# EAGLE design avrdmx (EAGLE 6.5.0)
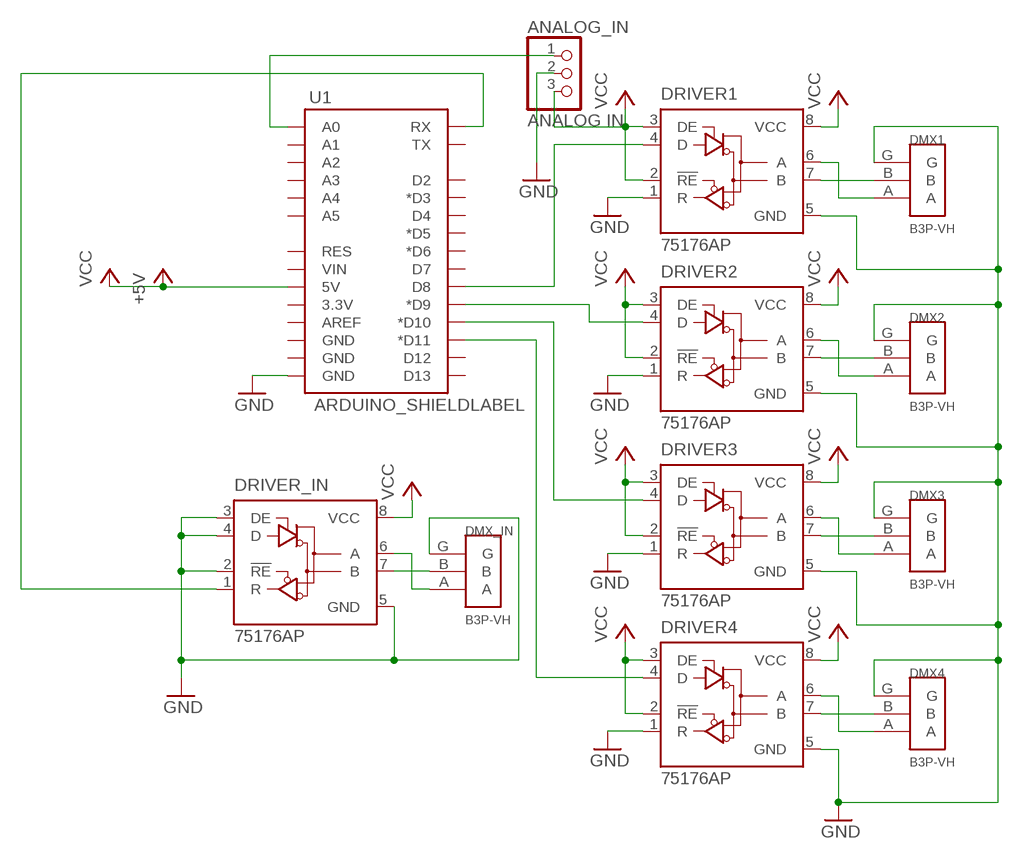
[diagram p0: schematic, sheet 1]

## Parts
ANALOG_IN  ANALOG IN  PINHD-1X3  [1X03]
DMX1  B3P-VH  [B3P-VH]
DMX2  B3P-VH  [B3P-VH]
DMX3  B3P-VH  [B3P-VH]
DMX4  B3P-VH  [B3P-VH]
DMX_IN  B3P-VH  [B3P-VH]
DRIVER1  75176AP  [DIL08]
DRIVER2  75176AP  [DIL08]
DRIVER3  75176AP  [DIL08]
DRIVER4  75176AP  [DIL08]
DRIVER_IN  75176AP  [DIL08]
U1  ARDUINO_SHIELDLABEL  [DUEMILANOVE_SHIELD]

## Nets
GND: ANALOG_IN.2 DMX1.G DMX2.G DMX3.G DMX4.G DMX_IN.G DRIVER1.1(R) DRIVER1.5(GND) DRIVER2.1(R) DRIVER2.5(GND) DRIVER3.1(R) DRIVER3.5(GND) DRIVER4.1(R) DRIVER4.5(GND) DRIVER_IN.2(!RE) DRIVER_IN.3(DE) DRIVER_IN.4(D) DRIVER_IN.5(GND) U1.GND@0(GND)
N$1: DRIVER1.4(D) U1.D8
N$2: DRIVER2.4(D) U1.D9(*D9)
N$3: DRIVER3.4(D) U1.D10(*D10)
N$4: DRIVER4.4(D) U1.D11(*D11)
N$5: ANALOG_IN.1 U1.A0
N$7: DMX_IN.B DRIVER_IN.7(B)
N$8: DMX1.B DRIVER1.7(B)
N$9: DRIVER_IN.1(R) U1.RX
N$10: DMX1.A DRIVER1.6(A)
N$11: DMX2.B DRIVER2.7(B)
N$12: DMX2.A DRIVER2.6(A)
N$13: DMX3.B DRIVER3.7(B)
N$14: DMX3.A DRIVER3.6(A)
N$15: DMX4.A DRIVER4.6(A)
N$16: DMX4.B DRIVER4.7(B)
N$17: DMX_IN.A DRIVER_IN.6(A)
VCC: ANALOG_IN.3 DRIVER1.2(!RE) DRIVER1.3(DE) DRIVER1.8(VCC) DRIVER2.2(!RE) DRIVER2.3(DE) DRIVER2.8(VCC) DRIVER3.2(!RE) DRIVER3.3(DE) DRIVER3.8(VCC) DRIVER4.2(!RE) DRIVER4.3(DE) DRIVER4.8(VCC) DRIVER_IN.8(VCC) U1.5V ; supply symbol labelled +5V
Unconnected: U1.3.3V U1.A1 U1.A2 U1.A3 U1.A4 U1.A5 U1.AREF U1.D2 U1.D3(*D3) U1.D4 U1.D5(*D5) U1.D6(*D6) U1.D7 U1.D12 U1.D13 U1.GND@1(GND) U1.GND@2(GND) U1.RES U1.TX U1.VIN

## Library data of the parts
ANALOG_IN = pinhead:PINHD-1X3: PIN HEADER
DMX1-DMX4 DMX_IN = avrdmx:B3P-VH
DRIVER1-DRIVER4 DRIVER_IN = 751xx:75176A: DIFFERENTIAL BUS TRANSCEIVER Source: http://focus.ti.com/lit/ds/symlink/sn75176a.pdf
U1 = SparkFun-Boards:ARDUINO_SHIELD: Arduino shield footprint

## Board
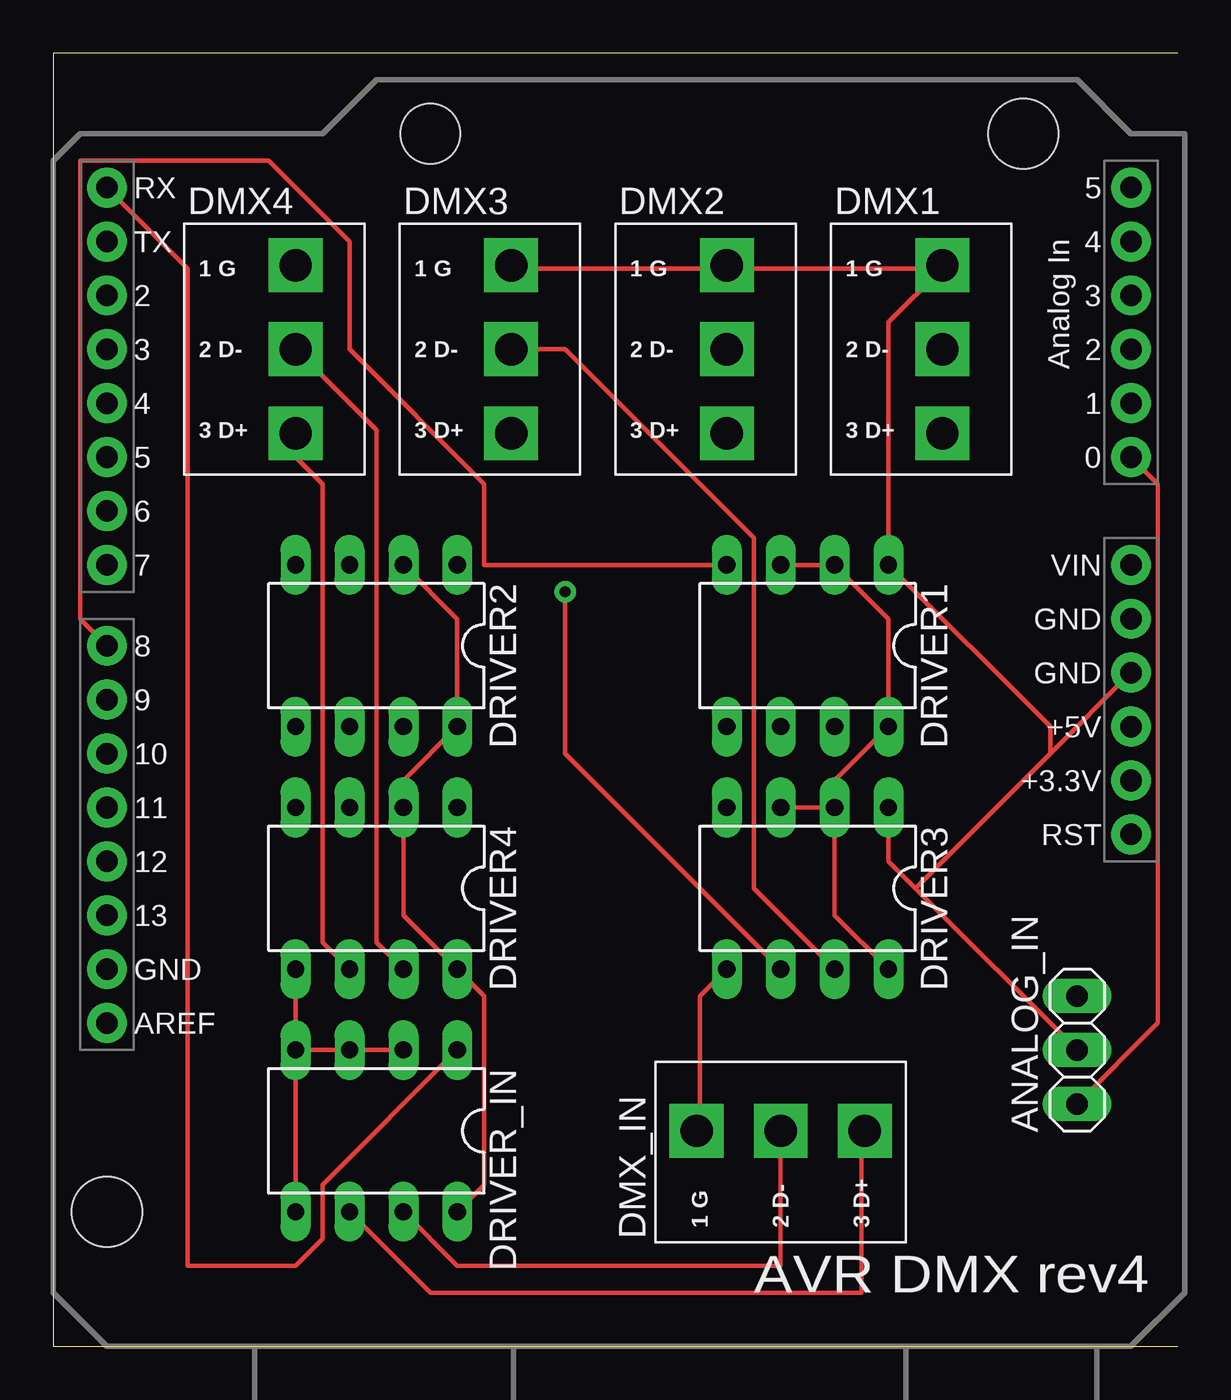
[diagram p1: board, top side]
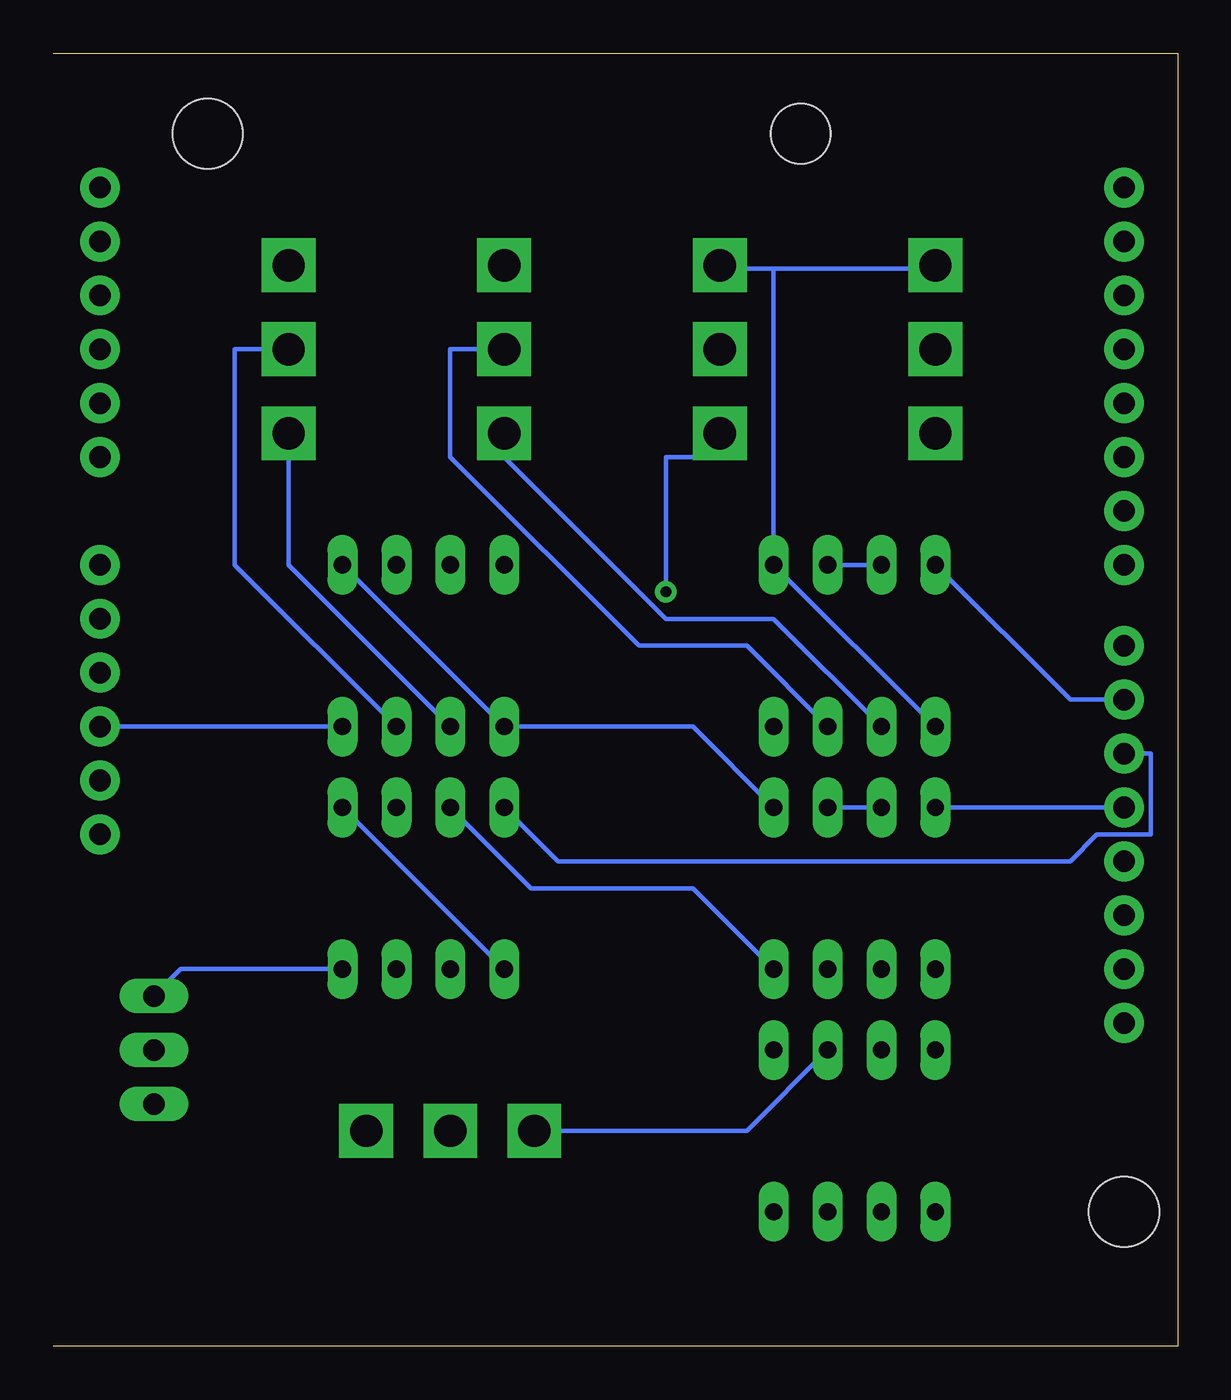
[diagram p2: board, bottom side, seen from below]

Size 53.01 x 60.95 mm. Coordinates in mm from the lower left corner, seen from the top.
Outline: 53.01,0 0,0 0,60.95 53.01,60.95
Copper layers (1*16): Top 0.035mm / dielectric 1.5mm / Bottom 0.035mm
Design rules "default": minimum track width 8mil, minimum drill 20mil, track to track 8mil, track to pad 8mil, pad to pad 8mil, via to via 8mil, smd to smd 8mil, copper to edge 10mil, drill to drill 8mil, minimum pad ring 12mil, minimum via ring 10mil, stop-mask expansion 4mil, vias tented up to drill 25mil, thermal gap 10mil
Holes 2.8 mm at 17.78,57.15

### Footprints (pad centres in the part's own frame; a part is rotated, then mirrored left to right if it is on the bottom)
1X03 = drill 1.016 long: 1 -2.54,0; 2 0,0; 3 2.54,0
B3P-VH = drill 1.524 pad 2.54 square: A 0,-3.96; B 0,0; G 0,3.96
DIL08 = drill 0.813 long: 1 -3.81,-3.81; 2 -1.27,-3.81; 3 1.27,-3.81; 4 3.81,-3.81; 5 3.81,3.81; 6 1.27,3.81; 7 -1.27,3.81; 8 -3.81,3.81
DUEMILANOVE_SHIELD = drill 1.016 pad 1.88: 3.3V 50.8,26.67; 5V 50.8,29.21; A0 50.8,41.91; A1 50.8,44.45; A2 50.8,46.99; A3 50.8,49.53; A4 50.8,52.07; A5 50.8,54.61; AREF 2.54,15.24; D2 2.54,49.53; D3 2.54,46.99; D4 2.54,44.45; D5 2.54,41.91; D6 2.54,39.37; D7 2.54,36.83; D8 2.54,33.02; D9 2.54,30.48; D10 2.54,27.94; D11 2.54,25.4; D12 2.54,22.86; D13 2.54,20.32; GND@0 50.8,31.75; GND@1 50.8,34.29; GND@2 2.54,17.78; RES 50.8,24.13; RX 2.54,54.61; TX 2.54,52.07; VIN 50.8,36.83 | hole 3.302: 45.72,57.15; 2.54,6.35

### Placement (x,y rotation side)
ANALOG_IN  48.26,13.97 90 top
DMX1  41.91,46.99 0 top
DMX2  31.75,46.99 0 top
DMX3  21.59,46.99 0 top
DMX4  11.43,46.99 0 top
DMX_IN  34.29,10.16 90 top
DRIVER1  35.56,33.02 180 top
DRIVER2  15.24,33.02 180 top
DRIVER3  35.56,21.59 180 top
DRIVER4  15.24,21.59 180 top
DRIVER_IN  15.24,10.16 180 top
U1  0,0 0 top

### Tracks (layer width: path | path; a pad name or v marks a point on that pad's centre or on a via)
GND
  Top 0.203: 31.75,50.8 21.59,50.8 DMX3.G | 31.75,50.8 41.91,50.8 | 31.75,50.8 DMX2.G | DRIVER_IN.4 DRIVER_IN.5 | DRIVER_IN.4 DRIVER_IN.3 DRIVER_IN.2 | DRIVER_IN.4 DRIVER4.5 | DRIVER3.5 30.48,16.51 30.48,10.16 DMX_IN.G | 40.64,21.59 39.37,22.86 DRIVER3.1 | 40.64,21.59 ANALOG_IN.2 | 40.64,21.59 46.99,27.94 | 46.99,27.94 U1.GND@0 | 46.99,27.94 46.99,29.21 DRIVER1.1 39.37,48.26 41.91,50.8 | 41.91,50.8 DMX1.G
  Bottom 0.203: DRIVER2.5 DRIVER2.1 19.05,50.8 | 19.05,50.8 21.59,50.8 DMX3.G | 19.05,50.8 11.43,50.8 DMX4.G | DRIVER4.1 22.86,29.21 DRIVER1.5 DRIVER1.1 | DRIVER3.5 DRIVER3.1 | DRIVER_IN.2 20.32,10.16 DMX_IN.G
N$1
  Top 0.203: DRIVER1.4 20.32,36.83 20.32,40.64 13.97,46.99 13.97,52.07 10.16,55.88 1.27,55.88 1.27,34.29 U1.D8
N$2
  Bottom 0.203: DRIVER2.4 5.08,30.48 U1.D9
N$3
  Bottom 0.203: DRIVER3.4 29.21,22.86 5.08,22.86 3.81,24.13 1.27,24.13 1.27,27.94 U1.D10
N$4
  Bottom 0.203: U1.D11 DRIVER4.4
N$5
  Top 0.203: ANALOG_IN.1 52.07,15.24 52.07,40.64 U1.A0
N$7
  Top 0.203: DRIVER_IN.7 19.05,3.81 34.29,3.81 DMX_IN.B
N$8
  Bottom 0.203: DRIVER1.7 44.45,36.83 44.45,46.99 DMX1.B
N$9
  Top 0.203: DRIVER_IN.1 12.7,7.62 12.7,5.08 11.43,3.81 6.35,3.81 6.35,50.8 U1.RX
N$10
  Bottom 0.203: DRIVER1.6 41.91,36.83 DMX1.A
N$11
  Bottom 0.203: DRIVER2.7 20.32,33.02 25.4,33.02 34.29,41.91 34.29,46.99 DMX2.B
N$12
  Bottom 0.203: DRIVER2.6 19.05,34.29 24.13,34.29 31.75,41.91 DMX2.A
N$13
  Top 0.203: DRIVER3.7 33.02,21.59 33.02,38.1 24.13,46.99 DMX3.B
N$14  (via drill 0.51)
  Top 0.203: DRIVER3.6 24.13,27.94 v24.13,35.56
  Bottom 0.203: v24.13,35.56 24.13,41.91 21.59,41.91 DMX3.A
N$15
  Top 0.203: DRIVER4.6 12.7,19.05 12.7,40.64 11.43,41.91 DMX4.A
N$16
  Top 0.203: DRIVER4.7 15.24,19.05 15.24,43.18 DMX4.B
N$17
  Top 0.203: DRIVER_IN.6 17.78,2.54 38.1,2.54 38.1,10.16 DMX_IN.A
VCC
  Top 0.203: DRIVER_IN.8 20.32,7.62 20.32,16.51 DRIVER4.8 16.51,20.32 DRIVER4.2 16.51,26.67 DRIVER2.8 19.05,34.29 DRIVER2.2 | DRIVER1.3 DRIVER1.2 39.37,34.29 DRIVER1.8 36.83,26.67 DRIVER3.2 | DRIVER3.2 DRIVER3.3 | DRIVER3.8 36.83,20.32 DRIVER3.2
  Bottom 0.203: DRIVER2.2 DRIVER2.3 | DRIVER4.2 DRIVER4.3 | ANALOG_IN.3 46.99,17.78 DRIVER3.8 | DRIVER1.8 U1.5V | DRIVER4.8 22.86,21.59 30.48,21.59 DRIVER3.3

### Text on the board
tPlace: AVR DMX rev4